# Altium schematic sheet SOLENOID.SchDoc
size A; SheetNumber: 10; SheetTotal: 11
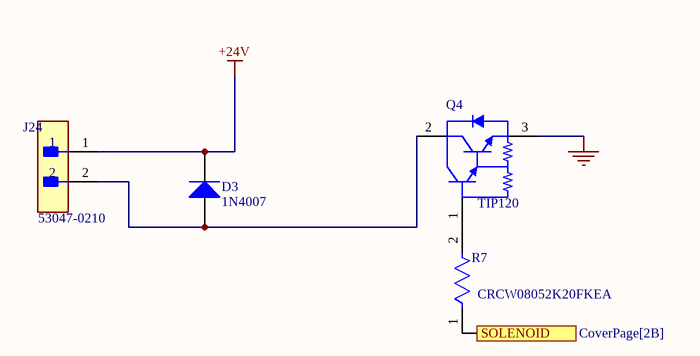
[diagram p0: SOLENOID.SchDoc]

## Parts
D3  1N4007  [FAIR-DO-41-2]
J24  53047-0210  [FP-53047-0210-MFG]
Q4  TIP120  [ONSC-TO-220-3-221A-09]
R7  CRCW08052K20FKEA  [FP-CRCW0805-e3-IPC_B]

## Ports
SOLENOID (see CoverPage[2B])

## Nets
+24V: D3.1(K) J24.1
GND: Q4.3(E)
SOLENOID: R7.1 ; port SOLENOID
NetD3_2: D3.2(A) J24.2 Q4.2(C)
NetQ4_1: Q4.1(B) R7.2

## Library data of the parts
D3 = CMP-004-00007-2: General Purpose Rectifier, 1.1 V, 1.0 A, -55 to 175 degC, 2-Pin DO-41, RoHS, Tape and Reel; Manufacturer: Fairchild; Peak Reverse Current: 5uA; Max Surge Current: 30A; Elements: 1; Forward Voltage: 1.1V; Package Version: Rev. 2, 09/2008; Forward Current: 1A; Package Quantity: 5000; Packaging: TapeandReel; Package URL: http://www.fairchildsemi.com/dwg/DO/DO41A.pdf; Manufacturer URL: https://www.fairchildsemi.com/; Package Reference: DO-41-2; Pins: 2; Min Operating Temperature: -55°C; Datasheet Version: Rev. 1.1.0, 11/2014; Max Operating Temperature: 175°C; RoHS Compliant: True; Case/Package: DO-41-2; Mounting Technology: TH; Package Description: 2-Pin Axial Lead, Dia 2.375 mm, Body Length 4.63 mm; Datasheet URL: https://www.fairchildsemi.com/datasheets/1N/1N4007.pdf
J24 = CMP-2000-05628-3: CONN HEADER VERT 2POS 1.25MM; Manufacturer: Molex; Conn Gender: Male; Voltage Rating: 125V; Conn Orientation: Vertical; Number Of Contacts: 2; Current Rating: 1A; Contact Material: Tin; Temperature Range Low: -40°C; ComponentLink2URL: http://www.molex.com/webdocs/datasheets/pdf/en-us/0530470210_PCB_HEADERS.pdf; Mouser Description: 1.25mm Pitch PicoBlade™ Wire-to-Board Header, Vertical, with Friction Lock, 2 Circuits; Manufacturer Part Number: 53047-0210; Temperature Range High: +85°C; ComponentLink2Description: Datasheet; Automotive: No; RoHS: TRUE; Ambient Temperature Range High: +85°C; Octopart: https://octopart.com/53047-0210-molex-276772; Footprint Url: https://www.molex.com/pdm_docs/sd/530470210_sd.pdf; Lead Free: Yes; Pitch: 1.25mm; Temperature: -40°C to +85°C; Device Class L2: Headers and Wire Housings; Package: 0; Ambient Temperature Range Low: -40°C; Digikey Description: CONN HEADER VERT 2POS 1.25MM; Category: Conn; Device Class L3: unset; Number Of Rows: 1; Device Class L1: Connectors; Height: 4.4mm
Q4 = CMP-013-00001-3: Plastic Medium-Power Complementary Silicon Transistor, 60 V VCEO, -65 to 150 degC, 3-Pin TO-220, RoHS, Tube; Manufacturer: ON Semiconductor; hFE Min: 1000; Package Version: Rev. AH, 08/2014; Vce Max: 4V; Package Quantity: 50; Pins: 3; Min Operating Temperature: -65°C; Datasheet Version: Rev. 9, 11/2014; Mounting Technology: TH; Package Description: 3-Pin Flange Mount, Vertical Straight Lead, Body 10.095 x 4.45 mm, Pitch 2.54 mm; Case/Package: TO-220-3; RoHS Compliant: True; Datasheet URL: http://www.onsemi.cn/pub_link/Collateral/TIP120-D.PDF; Packaging: Rail/Tube; Max Operating Temperature: 150°C; Package Reference: TO-220-3-221A-09
R7 = CMP-2001-03760-2: RES Thick Film, 2.2kΩ, 1%, 0.125W, 100ppm/°C, 0805; Voltage Rating (DC): 150V; Max Power Dissipation: 125mW; Resistance: 2.2kR; Case/Package: 0805; Width: 1.25mm; Voltage Rating: 150V; Composition: Thick Film; Power Rating: 125mW; Packaging: Tape and Reel; Min Operating Temperature: -55°C; Contact Plating: Tin; Tolerance: 1%; Military Standard: Not; Case Code (Metric): 2012; Radiation Hardening: No; Termination: SMD/SMT; Lead Free: Lead Free; Case Code (Imperial): 0805; Max Operating Temperature: 155°C; Depth: 1.25mm; Weight: 0.000194oz; Number of Terminations: 2; Length: 2mm; Package Quantity: 10; Temperature Coefficient: 100ppm/°C; Features: Automotive AEC-Q200; Height: 0.45mm